# Altium project EEG_MASTER_REV2.PrjPcb
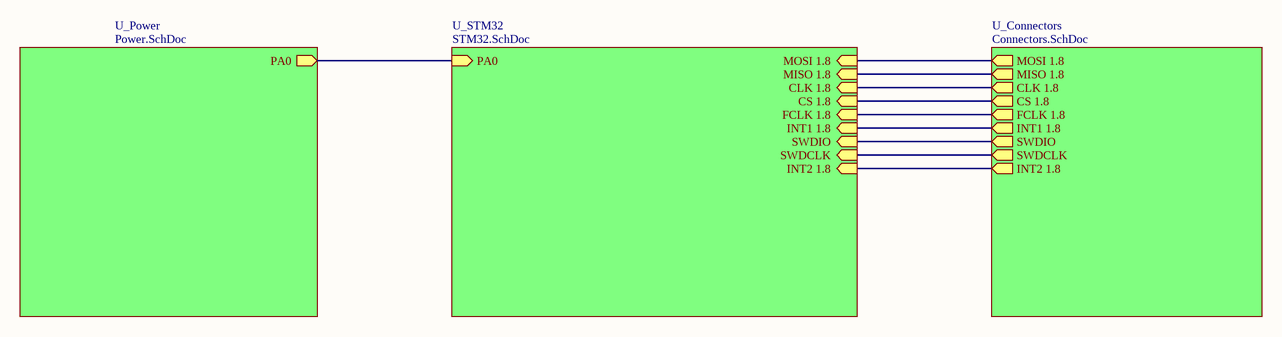
[diagram p0: Main.SchDoc]
4 sheets, 42 parts. Net scope: hierarchical (ports join the sheet entries above them; power ports are global).
Board files: EEG_Master_Rev2.PcbDoc, EEG_MASTER_REV2(2).PcbDoc, ALL_PCB.PcbDoc
Sheets:
  Main.SchDoc
    U_Power = Power.SchDoc
    U_STM32 = STM32.SchDoc
    U_Connectors = Connectors.SchDoc

## Sheet Main.SchDoc
size A4; SheetNumber: 1; SheetTotal: 4

### Sub-sheets
U_Connectors = Connectors.SchDoc: MISO 1.8 (out), MOSI 1.8 (out), CLK 1.8 (out), CS 1.8 (out), FCLK 1.8 (out), INT1 1.8 (out), SWDIO (out), SWDCLK (out), INT2 1.8 (out)
U_Power = Power.SchDoc: PA0 (out)
U_STM32 = STM32.SchDoc: MOSI 1.8 (in), MISO 1.8 (in), CLK 1.8 (in), CS 1.8 (in), FCLK 1.8 (in), SWDIO (in), SWDCLK (in), INT1 1.8 (in), PA0 (in), INT2 1.8 (in)

### Nets
CLK 1.8: sheet U_STM32/CLK 1.8, sheet U_Connectors/CLK 1.8
CS 1.8: sheet U_STM32/CS 1.8, sheet U_Connectors/CS 1.8
FCLK 1.8: sheet U_STM32/FCLK 1.8, sheet U_Connectors/FCLK 1.8
INT1 1.8: sheet U_STM32/INT1 1.8, sheet U_Connectors/INT1 1.8
INT2 1.8: sheet U_STM32/INT2 1.8, sheet U_Connectors/INT2 1.8
MISO 1.8: sheet U_STM32/MISO 1.8, sheet U_Connectors/MISO 1.8
MOSI 1.8: sheet U_STM32/MOSI 1.8, sheet U_Connectors/MOSI 1.8
PA0: sheet U_Power/PA0, sheet U_STM32/PA0
SWDCLK: sheet U_STM32/SWDCLK, sheet U_Connectors/SWDCLK
SWDIO: sheet U_STM32/SWDIO, sheet U_Connectors/SWDIO

## Sheet Power.SchDoc
size A4; SheetNumber: 2; SheetTotal: 4
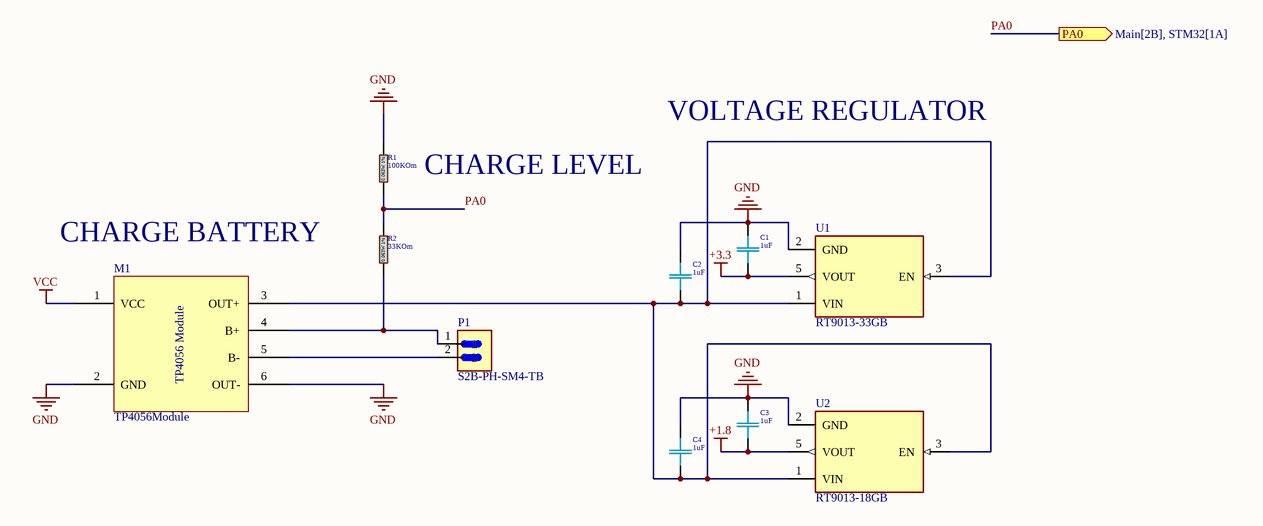
[diagram p1: Power.SchDoc]

### Parts
C1  1uF  [C 0402(1005)x0.5]
C2  1uF  [C 0402(1005)x0.5]
C3  1uF  [C 0402(1005)x0.5]
C4  1uF  [C 0402(1005)x0.5]
M1  TP4056Module  [TP4056Module]
P1  S2B-PH-SM4-TB  [JST_S2B-PH-SM4-TB]
R1  100KOm  [R 0402(1005)-1%]
R2  33KOm  [R 0402(1005)-1%]
U1  RT9013-33GB  [SOT94P279X129-5N]
U2  RT9013-18GB  [SOT94P279X129-5N]

### Ports
PA0 (out, see Main[2B], STM32[1A])

### Nets
+1.8: C3.2 U2.5(VOUT)
+3.3: C1.2 U1.5(VOUT)
GND: C1.1 C2.1 C3.1 C4.1 M1.2(GND) M1.6(OUT-) R1.2 U1.2(GND) U2.2(GND)
VCC: M1.1(VCC)
PA0: R1.1 R2.2 ; port PA0
NetC2_2: C2.2 C4.2 M1.3(OUT+) U1.1(VIN) U1.3(EN) U2.1(VIN) U2.3(EN)
NetM1_4: M1.4(B+) P1.1 R2.1
NetM1_5: M1.5(B-) P1.2

### Notes on the sheet
- VOLTAGE REGULATOR
- (near R1) CHARGE LEVEL
- CHARGE BATTERY
- (in symbol R 0402-1%) 0.063W 1%
- (in symbol TP4056Module) TP4056 Module

### Library data of the parts
C1-C4 = C 0402    16V X5R - 0*: SMD 0402     16V X5R 10%; Manufacturer: Samsung; TYPE: Capacitors; Tolerance %: ±20%; Package-mm: 1005; Part Number: *; Mount Type: SMT; Publisher: Hefest; Manufacturer Alternate: *; Part Number Alternate: *; Published: 07.04.2019; Supplier 1: Comet; Supplier Part Number 1: *; RoHS: Y; Technology: Ceramic  MLCC; Package: 0402; VDC: 16V; TempCo: X5R; VAC: *; ESR Ohm: *; ComponentLink1Description: Datasheet Link; ComponentLink1URL: https://store.comet.bg/download-file.php?id=11; Temperature Range: -55°C ~ +85°C; Price: *; Value: 1uF
M1 = TP4056Module: TP4056 Module for managing battery charging
P1 = S2B-PH-SM4-TB: Connector Header Surface Mount, Right Angle 2 position 0.079 (2.00mm); MF: JST Sales; Price: None; Availability: In Stock; Package: None; MP: S2B-PH-SM4-TB; Value: *; SnapEDA_Link: https://www.snapeda.com/parts/S2B-PH-SM4-TB/JST+Sales+America+Inc./view-part/?ref=snap; Purchase-URL: https://pricing.snapeda.com/search/part/S2B-PH-SM4-TB/?ref=eda; Check_prices: https://www.snapeda.com/parts/S2B-PH-SM4-TB/JST+Sales+America+Inc./view-part/?ref=eda
R1 R2 = R 0402-1%: SMD 0402 0.063W 1%   50V; Manufacturer: YAGEO; TempCo: ±100ppm/°C; Package-mm: 1005; Value Code: 1001; Power: 0.0625W; Part Number: *; Mount Type: SMT; Publisher: Hefest; Manufacturer Alternate: *; Published: 07.04.2019; Supplier 1: Comet; Supplier Part Number 1: R0402 1.0K 1% YAG/ASJ; RoHS: Y; Technology: Thick film; Package: 0402; VDC: 50V; Tolerance %: ±1%; ComponentLink1Description: Datasheet Link; ComponentLink1URL: https://store.comet.bg/download-file.php?id=1224; Temperature Range: -55°C ~ +155°C; Price: 0.015; Part Number Alternate: *; TYPE: Resistor
  R1: Value: 100KOm
  R2: Value: 33KOm
U1 U2 = RT9013-33GB: Linear Voltage Regulator IC 1 Output 500mA SOT-23-5; MF: Richtek USA; Availability: Unavailable; Price: None; SnapEDA_Link: https://www.snapeda.com/parts/RT9013-33GB/Richtek%20USA%20Inc./view-part/553199/?ref=snap; Value: *; MP: RT9013-33GB; Package: SOT-23-5 Richtek

## Sheet STM32.SchDoc
size A4; SheetNumber: 4; SheetTotal: 4
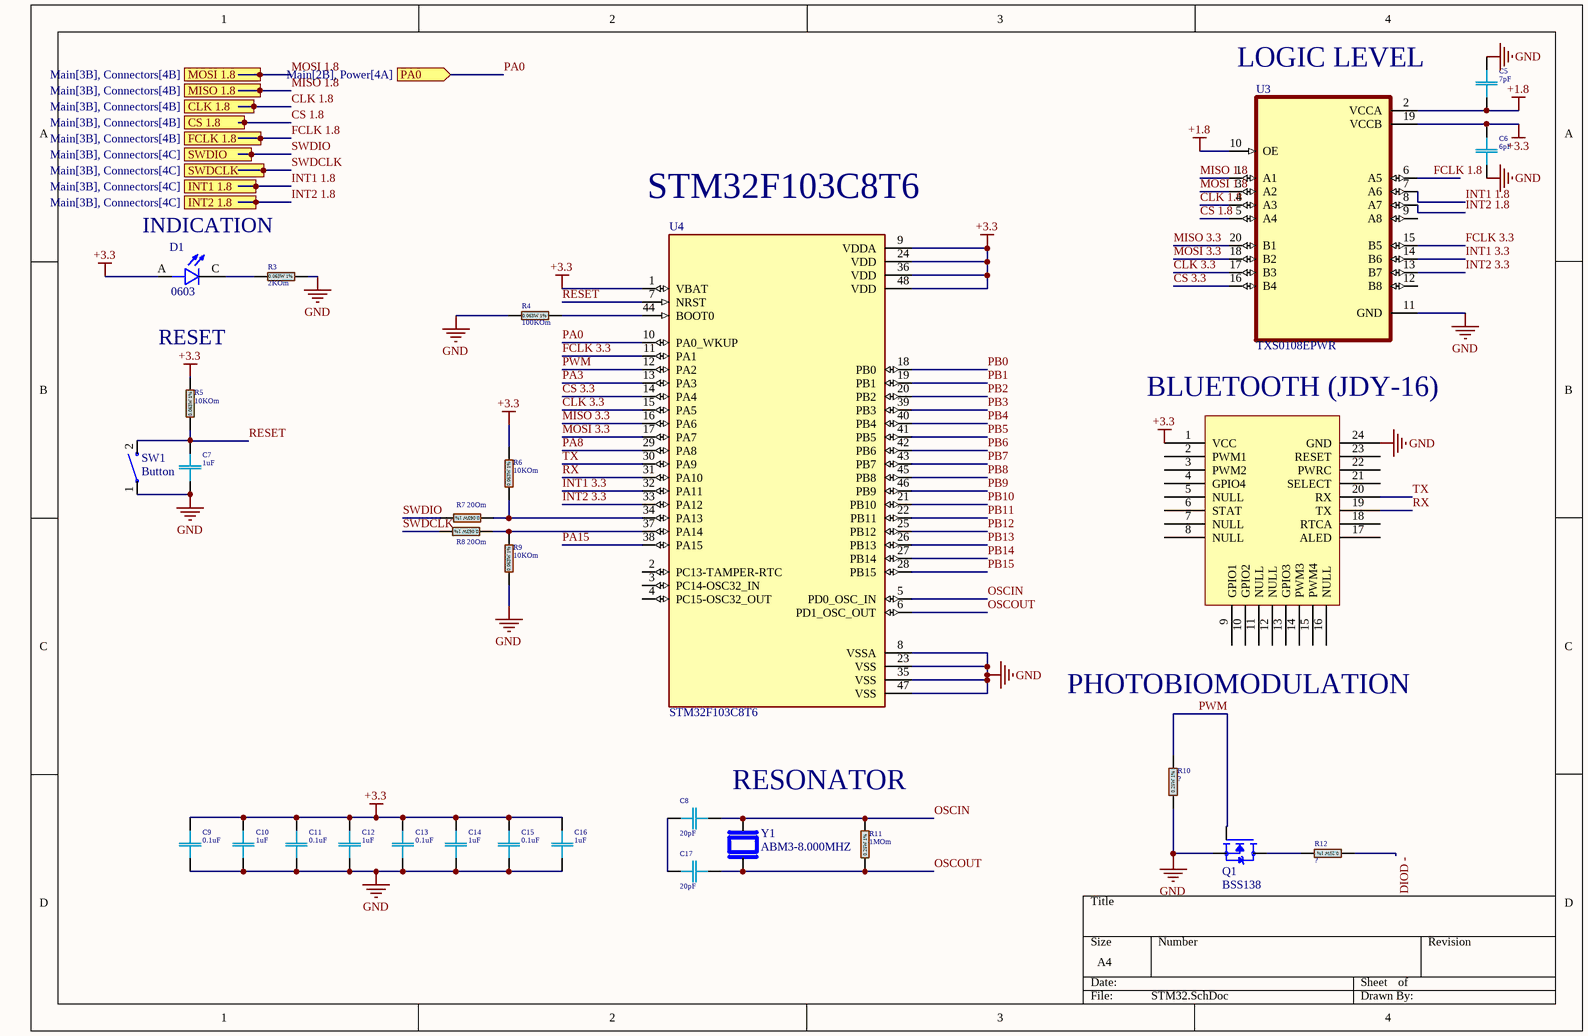
[diagram p2: STM32.SchDoc]

### Parts
C5  7pF  [C 0402(1005)x0.5]
C6  6pF  [C 0402(1005)x0.5]
C7  1uF  [C 0402(1005)x0.5]
C8  20pF  [C 0402(1005)x0.5]
C9  0.1uF  [C 0402(1005)x0.5]
C10  1uF  [C 0402(1005)x0.5]
C11  0.1uF  [C 0402(1005)x0.5]
C12  1uF  [C 0402(1005)x0.5]
C13  0.1uF  [C 0402(1005)x0.5]
C14  1uF  [C 0402(1005)x0.5]
C15  0.1uF  [C 0402(1005)x0.5]
C16  1uF  [C 0402(1005)x0.5]
C17  20pF  [C 0402(1005)x0.5]
D1  0603  [LEDC1608X65N]
JDY-16  JDY-16  [JDY-16]  (value not drawn)
Q1  BSS138  [SOT95P240X111-3N]
R3  2KOm  [R 0402(1005)-1%]
R4  100KOm  [R 0402(1005)-1%]
R5  10KOm  [R 0402(1005)-1%]
R6  10KOm  [R 0402(1005)-1%]
R7  20Om  [R 0402(1005)-1%]
R8  20Om  [R 0402(1005)-1%]
R9  10KOm  [R 0402(1005)-1%]
R10  ?  [R 1206(3216)-1%]
R11  1MOm  [R 1206(3216)-1%]
R12  ?  [R 1206(3216)-1%]
SW1  Button  [SW_1437566-3]
U3  TXS0108EPWR  [SOP65P640X120-20N]
U4  STM32F103C8T6  [QFP50P900X900X160-48N]
Y1  ABM3-8.000MHZ  [XTAL_ABM3-8.000MHZ-D2Y]

### Ports
CLK 1.8 (in, see Main[3B], Connectors[4B]), CS 1.8 (in, see Main[3B], Connectors[4B]), FCLK 1.8 (in, see Main[3B], Connectors[4B]), INT1 1.8 (in, see Main[3B], Connectors[4C]), INT2 1.8 (in, see Main[3B], Connectors[4C]), MISO 1.8 (in, see Main[3B], Connectors[4B]), MOSI 1.8 (in, see Main[3B], Connectors[4B]), PA0 (in, see Main[2B], Power[4A]), SWDCLK (in, see Main[3B], Connectors[4C]), SWDIO (in, see Main[3B], Connectors[4C])

### Nets
+1.8: C5.2 U3.2(VCCA) U3.10(OE)
+3.3: C6.1 C9.1 C10.1 C11.1 C12.1 C13.1 C14.1 C15.1 C16.1 D1.A JDY-16.1(VCC) R5.2 R6.2 U3.19(VCCB) U4.1(VBAT) U4.9(VDDA) U4.24(VDD) U4.36(VDD) U4.48(VDD)
GND: C5.1 C6.2 C7.2 C9.2 C10.2 C11.2 C12.2 C13.2 C14.2 C15.2 C16.2 JDY-16.24(GND) Q1.2(S) R3.2 R4.1 R9.1 R10.1 SW1.1 U3.11(GND) U4.8(VSSA) U4.23(VSS) U4.35(VSS) U4.47(VSS)
\: U3.14(B6) U4.32(PA11)  [also labelled INT1 3.3]
CLK 1.8: U3.4(A3) ; port CLK 1.8
CLK 3.3: U3.17(B3) U4.15(PA5)
CS 1.8: U3.5(A4) ; port CS 1.8
CS 3.3: U3.16(B4) U4.14(PA4)
DIOD -: R12.1
FCLK 1.8: U3.6(A5) ; port FCLK 1.8
FCLK 3.3: U3.15(B5) U4.11(PA1)
INT1 1.8: U3.7(A6) ; port INT1 1.8
INT2 1.8: U3.8(A7) ; port INT2 1.8
INT2 3.3: U3.13(B7) U4.33(PA12)
MISO 1.8: U3.1(A1) ; port MISO 1.8
MISO 3.3: U3.20(B1) U4.16(PA6)
MOSI 1.8: U3.3(A2) ; port MOSI 1.8
MOSI 3.3: U3.18(B2) U4.17(PA7)
OSCIN: C8.2 R11.2 U4.5(PD0_OSC_IN) Y1.2
OSCOUT: C17.2 R11.1 U4.6(PD1_OSC_OUT) Y1.1
PA0: U4.10(PA0_WKUP) ; port PA0
PA3: U4.13(PA3)
PA8: U4.29(PA8)
PA15: U4.38(PA15)
PB0: U4.18(PB0)
PB1: U4.19(PB1)
PB2: U4.20(PB2)
PB3: U4.39(PB3)
PB4: U4.40(PB4)
PB5: U4.41(PB5)
PB6: U4.42(PB6)
PB7: U4.43(PB7)
PB8: U4.45(PB8)
PB9: U4.46(PB9)
PB10: U4.21(PB10)
PB11: U4.22(PB11)
PB12: U4.25(PB12)
PB13: U4.26(PB13)
PB14: U4.27(PB14)
PB15: U4.28(PB15)
PWM: Q1.1(G) R10.2 U4.12(PA2)
RESET: C7.1 R5.1 SW1.2 U4.7(NRST)
RX: JDY-16.19(TX) U4.31(PA10)
SWDCLK: R8.2 ; port SWDCLK
SWDIO: R7.2 ; port SWDIO
TX: JDY-16.20(RX) U4.30(PA9)
NetC8_1: C8.1 C17.1
NetD1_C: D1.C R3.1
NetQ1_3: Q1.3(D) R12.2
NetR4_2: R4.2 U4.44(BOOT0)
NetR6_1: R6.1 R7.1 U4.34(PA13)
NetR8_1: R8.1 R9.2 U4.37(PA14)

Not connected (* = marked no-connect by the designer): JDY-16 2(PWM1) 3(PWM2) 4(GPIO4) 5(NULL) 6(STAT) 7(NULL) 8(NULL) 9(GPIO1) 10(GPIO2) 11(NULL) 12(NULL) 13(GPIO3) 14(PWM3) 15(PWM4) 16(NULL) 17(ALED) 18(RTCA) 21(SELECT) 22(PWRC) 23(RESET); U3 9(A8) 12(B8); U4 2(PC13-TAMPER-RTC) 3(PC14-OSC32_IN) 4(PC15-OSC32_OUT)

### Notes on the sheet
- (near U3) LOGIC LEVEL
- INDICATION
- (near U4) STM32F103C8T6
- RESET
- BLUETOOTH (JDY-16)
- PHOTOBIOMODULATION
- RESONATOR
- (in symbol R 0402-1%) 0.063W 1%
- (in symbol R 1206-1%) 0.25W 1%

### Library data of the parts
C5-C17 = C 0402    16V X5R - 0*: as C1 on sheet Power; Part Number: *; Mount Type: SMT; Publisher: Hefest; Manufacturer Alternate: *; Part Number Alternate: *; Published: 07.04.2019; Supplier 1: Comet; Supplier Part Number 1: *; RoHS: Y; Technology: Ceramic  MLCC; Package: 0402; VDC: 16V; TempCo: X5R; VAC: *; ESR Ohm: *; ComponentLink1Description: Datasheet Link; ComponentLink1URL: https://store.comet.bg/download-file.php?id=11; Temperature Range: -55°C ~ +85°C; Price: *
  C5: Value: 7pF
  C6: Value: 6pF
  C7 C10 C12 C14 C16: Value: 1uF
  C8 C17: Value: 20pF
  C9 C11 C13 C15: Value: 0.1uF
D1 = LTW-C191TLA: CHIP LED WHITE 0603 TOP VIEW; Package: None; Availability: Unavailable; MP: LTW-C191TLA; Value: *; Price: None
Q1 = BSS138: N-Channel 50 V 220mA (Ta) 350mW (Ta) Surface Mount SOT-23-3; MF: onsemi; SnapEDA_Link: https://www.snapeda.com/parts/BSS138/Onsemi/view-part/?ref=snap; Package: SOT-23-3 Motorola; Value: *; MP: BSS138; Check_prices: https://www.snapeda.com/parts/BSS138/Onsemi/view-part/?ref=eda
R3-R9 = R 0402-1%: as R1 on sheet Power; Part Number: *; Mount Type: SMT; Publisher: Hefest; Manufacturer Alternate: *; Published: 07.04.2019; Supplier 1: Comet; Supplier Part Number 1: R0402 1.0K 1% YAG/ASJ; RoHS: Y; Technology: Thick film; Package: 0402; VDC: 50V; Tolerance %: ±1%; ComponentLink1Description: Datasheet Link; ComponentLink1URL: https://store.comet.bg/download-file.php?id=1224; Temperature Range: -55°C ~ +155°C; Price: 0.015; Part Number Alternate: *; TYPE: Resistor
  R3: Value: 2KOm
  R4: Value: 100KOm
  R5 R6 R9: Value: 10KOm
  R7 R8: Value: 20Om
R10-R12 = R 1206-1%: SMD 1206 0.25W   1% 200V; Manufacturer: YAGEO; TempCo: ±100ppm/°C; Package-mm: 3216; Value Code: 1001; Part Number: *; Mount Type: SMT; Publisher: Hefest; Manufacturer Alternate: *; Published: 07.04.2019; Supplier 1: Comet; Supplier Part Number 1: R1206 1.0K 1% YAG/ASJ; RoHS: Y; Technology: Thick film; Package: 1206; VDC: 200V; Tolerance %: ±1%; ComponentLink1Description: Datasheet Link; ComponentLink1URL: https://store.comet.bg/download-file.php?id=1224; Temperature Range: -55°C ~ +155°C; Price: 0.069; Part Number Alternate: *; TYPE: Resistor; Power: 0.25W
  R10 R12: Value: ?
  R11: Value: 1MOm
SW1 = 1437566-3: Switch Tactile OFF (ON) SPST Rectangular Button Gull Wing 0.05A 12VDC SMD Loose Piece; Price: None; Value: *; Package: None; Availability: Unavailable; MP: 1437566-3
U3 = TXS0108EPWR: 8-bit bidirectional voltage-level shifter for open-drain and push-pull application; MF: Texas Instruments; Value: *; SnapEDA_Link: https://www.snapeda.com/parts/TXS0108EPWR/Texas+Instruments/view-part/?ref=snap; Purchase-URL: https://pricing.snapeda.com/search/part/TXS0108EPWR/?ref=eda; Availability: In Stock; Price: None; Package: TSSOP-20 Texas Instruments; Check_prices: https://www.snapeda.com/parts/TXS0108EPWR/Texas+Instruments/view-part/?ref=eda; MP: TXS0108EPWR
U4 = STM32F103C8T6: ARM® Cortex®-M3 STM32F1 Microcontroller IC 32-Bit 72MHz 64KB (64K x 8) FLASH 48-LQFP (7x7); MF: STMicroelectronics; SnapEDA_Link: https://www.snapeda.com/parts/STM32F103C8T6/STMicroelectronics/view-part/?ref=snap; Package: LQFP-48 STMicroelectronics; Value: *; MP: STM32F103C8T6; Check_prices: https://www.snapeda.com/parts/STM32F103C8T6/STMicroelectronics/view-part/?ref=eda
Y1 = ABM3-8.000MHZ-D2Y: 8 MHz Â±20ppm Crystal 18pF 140 Ohms 2-SMD, No Lead; MF: Abracon; Package: SMD-2 Abracon; Check_prices: https://www.snapeda.com/parts/ABM3-8.000MHZ-D2Y/Abracon/view-part/?ref=eda; Purchase-URL: https://pricing.snapeda.com/search/part/ABM3-8.000MHZ-D2Y/?ref=eda; Price: None; MP: ABM3-8.000MHZ-D2Y; Value: *; Availability: In Stock; SnapEDA_Link: https://www.snapeda.com/parts/ABM3-8.000MHZ-D2Y/Abracon/view-part/?ref=snap

## Sheet Connectors.SchDoc
size A4; SheetNumber: 3; SheetTotal: 4
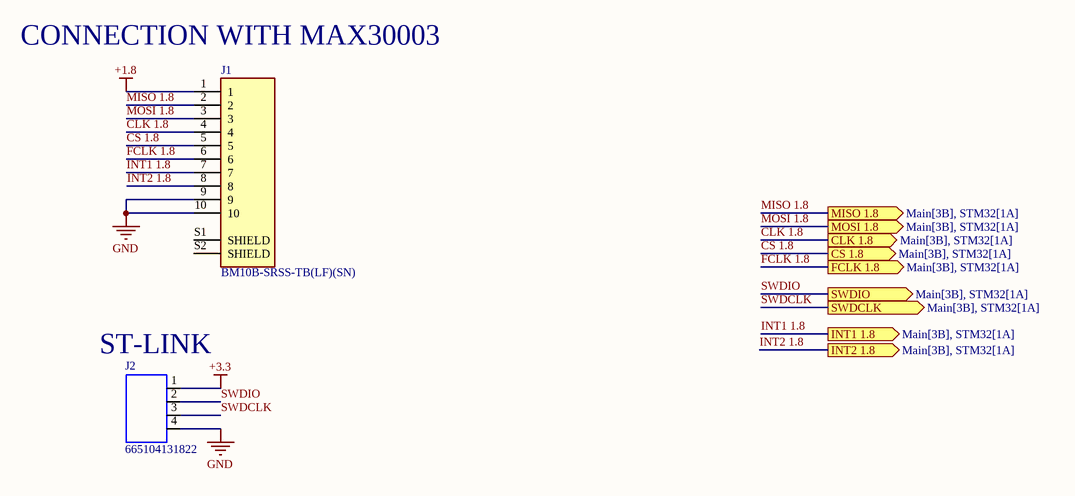
[diagram p3: Connectors.SchDoc]

### Parts
J1  BM10B-SRSS-TB(LF)(SN)  [JST_BM10B-SRSS-TB(LF)(SN)]
J2  665104131822  [665104131822]

### Ports
CLK 1.8 (out, see Main[3B], STM32[1A]), CS 1.8 (out, see Main[3B], STM32[1A]), FCLK 1.8 (out, see Main[3B], STM32[1A]), INT1 1.8 (out, see Main[3B], STM32[1A]), INT2 1.8 (out, see Main[3B], STM32[1A]), MISO 1.8 (out, see Main[3B], STM32[1A]), MOSI 1.8 (out, see Main[3B], STM32[1A]), SWDCLK (out, see Main[3B], STM32[1A]), SWDIO (out, see Main[3B], STM32[1A])

### Nets
+1.8: J1.1
+3.3: J2.1
GND: J1.9 J1.10 J2.4
CLK 1.8: J1.4 ; port CLK 1.8
CS 1.8: J1.5 ; port CS 1.8
FCLK 1.8: J1.6 ; port FCLK 1.8
INT1 1.8: J1.7 ; port INT1 1.8
INT2 1.8: J1.8 ; port INT2 1.8
MISO 1.8: J1.2 ; port MISO 1.8
MOSI 1.8: J1.3 ; port MOSI 1.8
SWDCLK: J2.3 ; port SWDCLK
SWDIO: J2.2 ; port SWDIO

Not connected (* = marked no-connect by the designer): J1 S1(SHIELD) S2(SHIELD)

### Notes on the sheet
- (near J1) CONNECTION WITH MAX30003
- (near J2) ST-LINK

### Library data of the parts
J1 = BM10B-SRSS-TB(LF)(SN): Connector Header Surface Mount 10 position 0.039 (1.00mm); MF: JST Sales; MP: BM10B-SRSS-TB(LF)(SN); Package: None; Check_prices: https://www.snapeda.com/parts/BM10B-SRSS-TB(LF)(SN)/JST+Sales+America+Inc./view-part/?ref=eda; SnapEDA_Link: https://www.snapeda.com/parts/BM10B-SRSS-TB(LF)(SN)/JST+Sales+America+Inc./view-part/?ref=snap; Availability: In Stock; Price: None; Value: *
J2 = 665104131822: Connector Header Surface Mount, Right Angle 4 position 0.039 (1.00mm); MF: Wurth Electronics; MP: 665104131822; Package: None; Price: None; Availability: Unavailable; SnapEDA_Link: https://www.snapeda.com/parts/665104131822/Wurth%20Electronics%20Inc./view-part/2395929/?ref=snap; Value: *

## Nets that join several sheets
+1.8: Power (C3.2 U2.5), STM32 (C5.2 U3.2 U3.10), Connectors (J1.1)
+3.3: Power (C1.2 U1.5), STM32 (19 pins), Connectors (J2.1)
GND: Power (9 pins), STM32 (23 pins), Connectors (J1.9 J1.10 J2.4)
CLK 1.8: STM32 (U3.4), Connectors (J1.4)
CS 1.8: STM32 (U3.5), Connectors (J1.5)
FCLK 1.8: STM32 (U3.6), Connectors (J1.6)
INT1 1.8: STM32 (U3.7), Connectors (J1.7)
INT2 1.8: STM32 (U3.8), Connectors (J1.8)
MISO 1.8: STM32 (U3.1), Connectors (J1.2)
MOSI 1.8: STM32 (U3.3), Connectors (J1.3)
PA0: Power (R1.1 R2.2), STM32 (U4.10)
SWDCLK: STM32 (R8.2), Connectors (J2.3)
SWDIO: STM32 (R7.2), Connectors (J2.2)